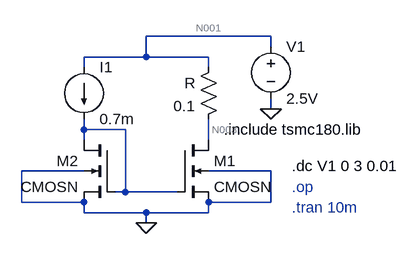
[diagram p0: schematic current_mirror_mosfet.asc]
current_mirror_mosfet.asc, the LTspice schematic file:
Version 4.1
SHEET 1 880 680
WIRE 400 32 208 32
WIRE 400 48 400 32
WIRE 208 64 208 32
WIRE 208 64 112 64
WIRE 304 64 208 64
WIRE 112 80 112 64
WIRE 304 80 304 64
WIRE 400 144 400 128
WIRE 112 176 112 160
WIRE 176 176 112 176
WIRE 112 192 112 176
WIRE 304 192 304 160
WIRE 112 240 16 240
WIRE 400 240 304 240
WIRE 176 272 176 176
WIRE 176 272 160 272
WIRE 256 272 176 272
WIRE 16 288 16 240
WIRE 112 288 16 288
WIRE 400 288 400 240
WIRE 400 288 304 288
WIRE 112 304 112 288
WIRE 208 304 112 304
WIRE 304 304 304 288
WIRE 304 304 208 304
WIRE 208 320 208 304
FLAG 208 320 0
FLAG 400 144 0
SYMBOL voltage 400 32 R0
SYMATTR InstName V1
SYMATTR Value 2.5V
SYMBOL nmos4 256 192 R0
SYMATTR InstName M1
SYMATTR Value CMOSN
SYMATTR Value2 l=0.18um w=300nm
SYMBOL nmos4 160 192 M0
SYMATTR InstName M2
SYMATTR Value CMOSN
SYMATTR Value2 l=0.18um w=300nm
SYMBOL current 112 80 R0
SYMATTR InstName I1
SYMATTR Value 0.7m
SYMBOL res 320 64 M0
SYMATTR InstName R
SYMATTR Value 0.1
TEXT 328 176 Left 2 !.include tsmc180.lib
TEXT 432 232 Left 2 !.dc V1 0 3 0.01
TEXT 432 264 Left 2 ;.op
TEXT 432 296 Left 2 ;.tran 10m

The netlist it stands for:
* current_mirror_mosfet.asc
V1 N001 0 2.5V
M1 N003 N002 0 0 CMOSN l=0.18um w=300nm
M2 N002 N002 0 0 CMOSN l=0.18um w=300nm
I1 N001 N002 0.7m
R N001 N003 0.1
.model NMOS NMOS
.model PMOS PMOS
.lib standard.mos
.include tsmc180.lib
.dc V1 0 3 0.01
* .op
* .tran 10m
.backanno
.end

* Results of the author's LTspice run, read from the files saved beside the schematic
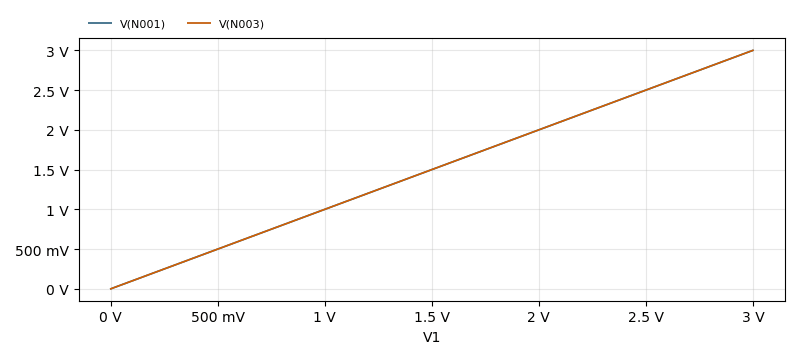
[diagram p1: DC transfer characteristic of current_mirror_mosfet.asc, plotted from the saved traces]
* DC transfer characteristic, 1 run:
*   V(N001): 0 V at V1=0 V, 3 V at V1=3 V, min 0 V, max 3 V
*   V(N003): 3.671e-05 fV at V1=0 V, 3 V at V1=3 V, min 3.671e-05 fV, max 3 V